# EasyEDA Pro project ProDoc_PCB1_2024-09-23.epro

# Board PCB1
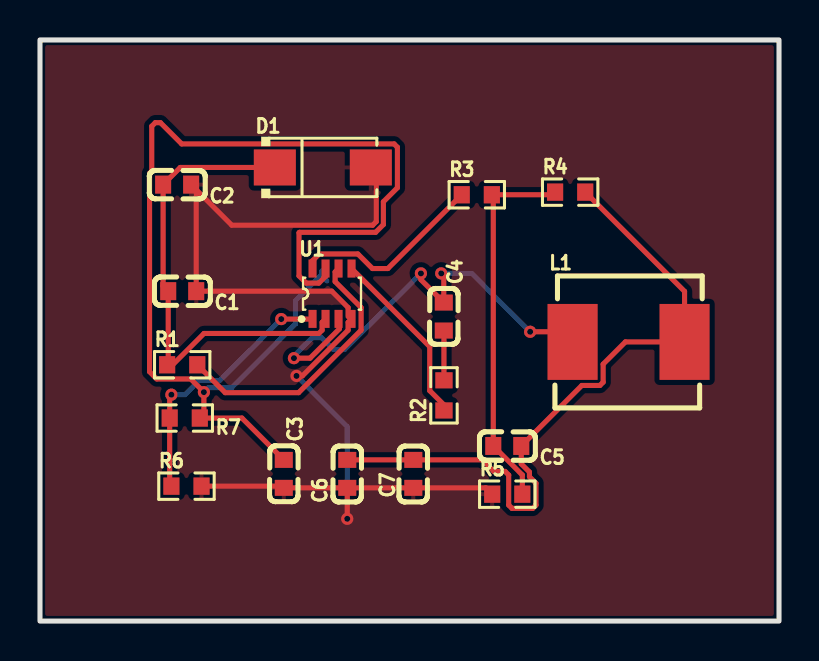
[diagram p0: board, top side]
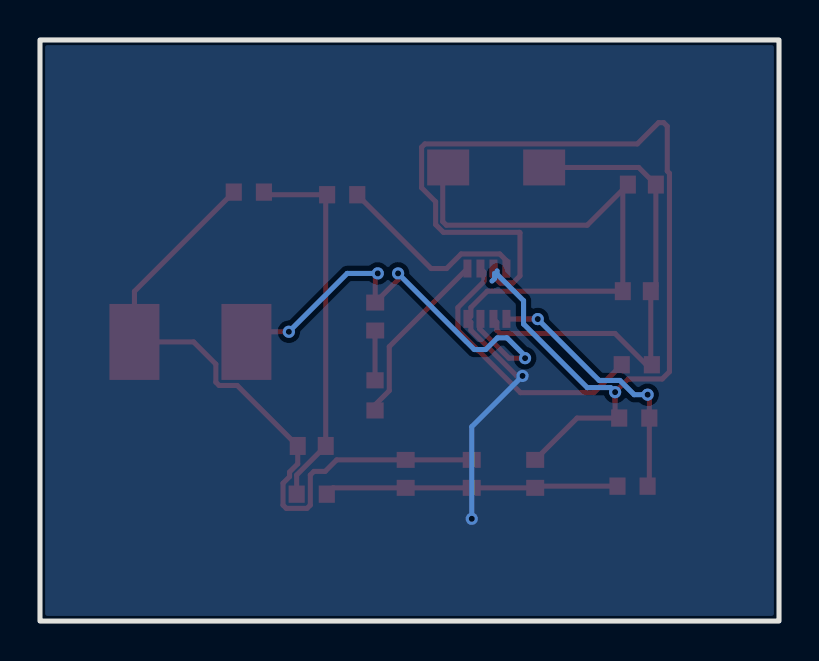
[diagram p1: board, bottom side, seen from below]

Outline 36.96 x 29.08 mm; copper layers: Top Layer, Bottom Layer. Coordinates in mm from the lower left corner of the outline.
Outline path: rectangle 0,29.08 36.96,0
Stack: Top Layer 0.035mm / Dielectric1 1.51mm FR4 er 4.5 / Bottom Layer 0.035mm

## Design rules (mm)
template: JLCPCB Capability(Two Layers Board)
spacing copperThickness1oz (default): track to track 0.102, other pairs 0.152 to 0.3
spacing copperThickness2oz: track to track 0.203, other pairs 0.152 to 0.3
track width copperThickness1oz (default): min 0.127, default 0.254, max 2.54
track width copperThickness2oz: min 0.203, default 0.254, max 2.54
differential pair differentialPair (default): width min 0.127, default 0.254, max 2.54; gap min 0.152, default 0.152
via viaSize (default): diameter min 0.5, default 0.61, max 10; hole min 0.3, default 0.305, max 6.3

## Placement (name value [footprint] x y rotation side)
C1  22uF  [C0603]  7.11 16.51 180 top
C2  0.1uF  [C0603]  6.86 21.84 180 top
C3  0.1uF  [C0603]  12.19 7.37 270 top
C4  0.1uF  [C0603]  20.19 15.24 270 top
C5  33pf  [C0603]  23.37 8.76 180 top
C6  22uF  [C0603]  15.37 7.37 90 top
C7  22uF  [C0603]  18.67 7.37 90 top
D1  SMAJ24A  [SMA_L4.3-W2.7-LS5.1-RD]  14.14 22.7 0 top
L1  4.7uH  [IND-SMD_L7.1-W6.6-1]  29.43 13.97 0 top
R1  100k  [R0603]  7.11 12.83 0 top
R2  10R  [R0603]  20.2 11.29 90 top
R3  20k  [R0603]  21.84 21.34 0 top
R4  40.2k  [R0603]  26.51 21.47 0 top
R5  7.5k  [R0603]  23.37 6.35 0 top
R6  7.5k  [R0603]  7.32 6.75 0 top
R7  100k  [R0603]  7.24 10.16 180 top
U1  MP2315SGJ-Z  [TSOT-23-8_L2.9-W1.6-P0.65-LS2.8-BL]  14.6 16.38 0 top

## Footprints (pads in the part's own frame, mm; a bottom-side part is the same pattern mirrored in y, then rotated)
C0603
  rect 0.8x0.9 smd: 1(-0.7,0) 2(0.7,0)
IND-SMD_L7.1-W6.6-1
  rect 2.5x3.8 smd: 1(-2.8,0) 2(2.8,0)
R0603
  rect 0.806x0.864 smd: 1(-0.753,0) 2(0.753,0)
SMA_L4.3-W2.7-LS5.1-RD
  rect 2.1x1.8 smd: 1(-2.4,0) 2(2.4,0)
TSOT-23-8_L2.9-W1.6-P0.65-LS2.8-BL
  rect 0.4x0.9 smd: 1(-0.975,-1.26) 2(-0.325,-1.26) 3(0.325,-1.26) 4(0.975,-1.26) 5(0.975,1.26) 6(0.325,1.26) 7(-0.325,1.26) 8(-0.975,1.26)

## Nets
5V: C5.1 C6.2 C7.2 L1.2 R4.2
24V: C1.2 C2.2 D1.1 R1.1 U1.2
GND: C1.1 C2.1 C3.2 C6.1 C7.1 D1.2 R5.1 R6.2 U1.4
$1N1160: R1.2 U1.6
$1N1172: C3.1 R7.1 U1.7
$1N1427: C4.1 L1.1 U1.3
$1N1678: R2.1 U1.5
$1N1734: C4.2 R2.2
$1N1822: C5.2 R3.2 R4.1 R5.2
$1N2241: R3.1 U1.8
$1N2456: R6.1 R7.2 U1.1

## Via types
v1: diameter 0.61, hole 0.305, Top Layer to Bottom Layer, 9 vias

## Routing (per net, layer and track width the routed paths; a pad name or vN(x,y) marks a point on that pad's centre or on a via; arc(x,y) is an arc through that point)
5V: length 35.1
  Top Layer w0.254: R4.2 32.23,16.5 32.23,13.97 29.27,13.97 28.16,12.86 28.16,11.95 28,11.79 27.1,11.79 C5.1 24.07,7.87 24.48,7.46 24.48,7.22 24.8,6.9 24.8,5.8 24.64,5.64 23.6,5.64 23.44,5.8 23.44,7.31 23.26,7.49 22.7,7.49 22.12,8.07 C7.2 C6.2
24V: length 24.2
  Top Layer w0.254: U1.2 14.11,14.95 14.11,14.56 13.95,14.39 8.2,14.39 6.64,12.83 R1.1 6.41,12.88 C1.2 6.16,16.76 6.16,21.84 7.02,22.7 11.74,22.7
GND: length 55.1
  Top Layer w0.254: 15.41,15.24 15.41,15.69 14.59,16.51 C1.1 7.81,21.59 ; R5.1 22.3,6.67 C7.1 C6.1 ; D1.2 16.82,22.43 16.82,19.99 16.64,19.81 9.59,19.81 7.81,21.59 ; v1(12.83,12.27) 13.12,12.27 15.41,14.56 15.41,14.95 U1.4 ; R6.2 12.11,6.75 C3.2 C6.1 ; C6.1 15.37,5.12 v1(15.36,5.12) ; 7.81,21.59 C2.1
  Bottom Layer w0.254: v1(12.83,12.27) 15.36,9.73 v1(15.36,5.12)
$1N1160: length 13.8
  Top Layer w0.254: R1.2 9.26,11.43 12.93,11.43 16.06,14.56 16.06,15.69 14.76,16.99 14.76,17.47 U1.6
$1N1172: length 57.1
  Top Layer w0.254: U1.7 14.28,17.25 13.95,16.91 13.31,16.91 12.95,17.27 12.95,19.43 12.98,19.46 16.78,19.46 17.17,19.84 17.17,20.99 17.87,21.69 17.87,23.72 17.71,23.88 7.09,23.88 6.02,24.94 5.77,24.94 5.59,24.77 5.59,22.52 5.48,22.41 5.48,12.48 5.84,12.12 7.54,12.12 v1(8.2,11.46) 8.2,10.36 R7.1 10.1,10.16 C3.1
  Bottom Layer w0.254: v1(8.2,11.46) 8.42,11.68 9.59,11.68 12.78,14.87 12.78,16.04 14.1,17.36 14.1,17.53 ; 14.22,17.4 14.22,17.14 14.35,17.02
$1N1427: length 23.5
  Top Layer w0.254: U1.3 14.97,15.08 14.97,14.62 13.5,13.16 v1(12.7,13.16) ; v1(19.05,17.4) 19.05,17.08 C4.1 20.19,17.27 v1(20.07,17.4) ; L1.1 26.13,14.48 v1(24.51,14.48)
  Bottom Layer w0.254: v1(24.51,14.48) 21.59,17.4 v1(20.07,17.4) ; v1(19.05,17.4) 15.24,13.59 14.67,13.59 14.08,14.17 13.6,14.17 12.7,13.27 v1(12.7,13.16)
$1N1678: length 9
  Top Layer w0.254: R2.1 20.2,10.82 19.49,11.53 19.49,13.73 U1.5
$1N1734: length 2.5
  Top Layer w0.254: R2.2 20.2,14.53 C4.2
$1N1822: length 18.8
  Top Layer w0.254: R5.2 24.12,7.31 C5.2 22.67,21.27 R3.2 25.63,21.34 25.76,21.47
$1N2241: length 9.8
  Top Layer w0.254: U1.8 13.63,18.04 13.96,18.37 15.9,18.37 16.62,17.64 17.4,17.64 R3.1
$1N2456: length 13.4
  Top Layer w0.254: R6.1 6.49,6.84 R7.2 6.49,11.24 v1(6.57,11.33) ; v1(12.06,15.11) 13.62,15.11 U1.1
  Bottom Layer w0.254: v1(12.06,15.11) 8.99,12.04 7.95,12.04 7.24,11.33 v1(6.57,11.33) ; 12.13,15.05 12.19,15.11

## Copper pours and planes (outline as drawn; the poured copper is in the pictures)
GND on Top Layer: -3.56,30.99 38.86,30.99 38.86,-2.79 -3.56,-2.79
GND on Bottom Layer: -0.89,29.97 37.97,29.97 37.97,-1.14 -0.89,-1.14
